# EAGLE design fl3xwatch (EAGLE 9.6.2)
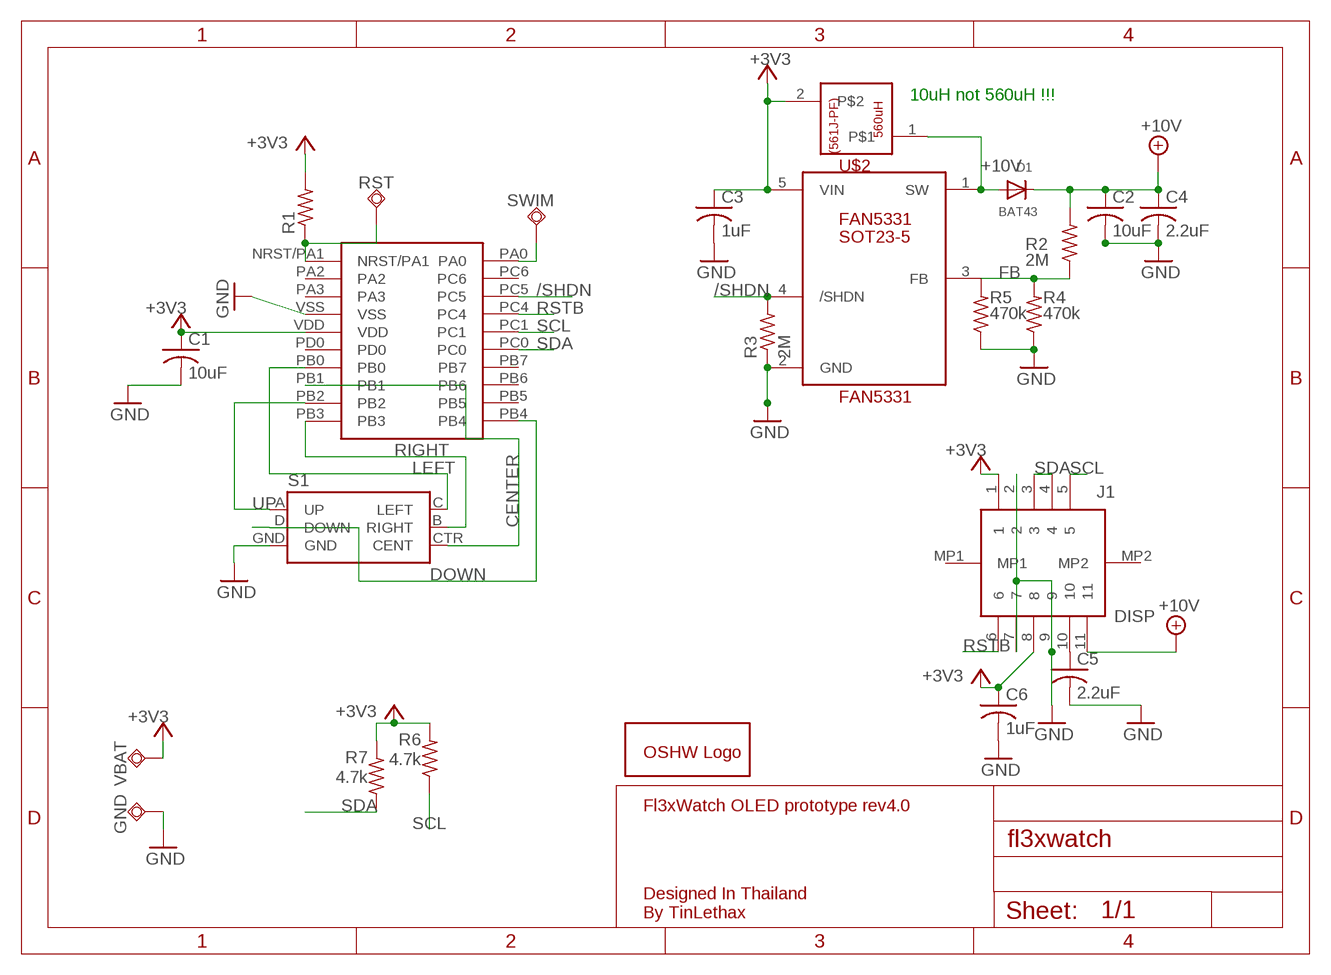
[diagram p0: schematic, sheet 1]

## Parts
C1  10uF  C-USC0805  [C0805]
C2  10uF  C-USC0805  [C0805]
C3  1uF  C-USC0603  [C0603]
C4  2.2uF  C-USC0603  [C0603]
C5  2.2uF  C-USC0603  [C0603]
C6  1uF  C-USC0603  [C0603]
D1  BAT43  DIODESOD-323F  [SOD-323F]
GND  TPSQTP20SQ  [TP20SQ]
GOLD_ORB_SM1  OSHWLOGOLOGO5MM  [OSHW_5MM]
J1  DISP  FH35C-11S-0.3SHW_50_  [FH35C11S03SHW50]
L1  10uH  NL453232T-561J-PF  [INDC4526X50N]
R1  R-US_R0603  [R0603]
R2  2M  R-US_R0603  [R0603]
R3  2M  R-US_R0603  [R0603]
R4  470k  R-US_R0805  [R0805]
R5  470k  R-US_R0805  [R0805]
R6  4.7k  R-US_R0603  [R0603]
R7  4.7k  R-US_R0603  [R0603]
RST  TPSQTP15R  [TP15R]
S1  SPARKFUN-ELECTROMECHANICAL_JOYSTICK_MINI  [SPARKFUN-ELECTROMECHANICAL_JOYSTICK_MINI]
SWIM  TPSQTP15R  [TP15R]
U$1  STM8L151F3  [UFQFPN-20]
U$2  FAN5331  [SOT95P280X145-5N]
VBAT  TPSQTP20SQ  [TP20SQ]

## Nets
+3V3: C1.1 C3.1 C6.1 J1.1 J1.8 L1.2 R1.2 R6.2 R7.2 U$1.VDD U$2.5(VIN) VBAT.TP
+10V: C2.1 C4.1 D1.C J1.11 R2.2
/SHDN: R3.2 U$1.PC5 U$2.4(/SHDN)
CENTER: S1.CTR(CENT) U$1.PB1
DOWN: S1.D(DOWN) U$1.PB4
FB: R2.1 R4.2 R5.2 U$2.3(FB)
GND: C1.2 C2.2 C3.2 C4.2 C5.2 C6.2 GND.TP J1.2 J1.7 J1.9 R3.1 R4.1 R5.1 S1.GND U$1.VSS U$2.2(GND)
LEFT: S1.C(LEFT) U$1.PB0
N$1: R1.1 RST.TP U$1.NRST/PA1
N$2: C5.1 J1.10
RIGHT: S1.B(RIGHT) U$1.PB3
RSTB: J1.6 U$1.PC4
SCL: J1.5 R6.1 U$1.PC1
SDA: J1.3 J1.4 R7.1 U$1.PC0
SW: D1.A L1.1 U$2.1(SW)
SWIM: SWIM.TP U$1.PA0
UP: S1.A(UP) U$1.PB2
Unconnected: J1.MP1 J1.MP2 U$1.PA2 U$1.PA3 U$1.PB5 U$1.PB6 U$1.PB7 U$1.PC6 U$1.PD0

## Notes on the sheet
- 10uH not 560uH !!!
- Fl3xWatch OLED prototype rev4.0
- Designed In Thailand
  By TinLethax

## Library data of the parts
C1-C6 = adafruit:C-US: CAPACITOR, American symbol
D1 = adafruit:DIODE: Diode SMADIODE - SMA Surface Mount Package 20V 1A Schottky Diode Digikey: 641-1014-6-ND DO-1N4148 - Through Hole Small Current Diode SOD-123 20V 1 A (.5mV Vf) Schottky Diode - Digikey: MBRX120TPMSCT-ND SOD-323 10V 570mA (.38mV Vf, 3ns) Schottky Diode - Digikey: ZLLS410CT-ND SOD-523 30V 30mA Schottky Diode (RB751S-40TE61) - Digikey: RB751S-40TE61CT-ND SOT23-R/W - SOT23 Package (R = Solder Paste/Reflow Ovens, W = Hand-Soldering) BAT54Film 40V 300mA - Digikey: 497-7162-1-ND
GND RST SWIM VBAT = testpad:TPSQ: Test pad
GOLD_ORB_SM1 = oshw:OSHWLOGO: The OSHW logo for PCB layout
J1 = FH35C-11S-0.3SHW_50_:FH35C-11S-0.3SHW_50_: FFC & FPC Connectors 11P BCKFLP DUAL-SIDE FPC 0.3mm P 0.9mm H Source: Datasheet <http://www.mouser.com/datasheet/2/185/FH35C_catalog-939278.pdf>; DESCRIPTION: FFC & FPC Connectors 11P BCKFLP DUAL-SIDE FPC 0.3mm P 0.9mm H; HEIGHT: 1.8mm; MANUFACTURER_NAME: Hirose; MANUFACTURER_PART_NUMBER: FH35C-11S-0.3SHW(50); MOUSER_PART_NUMBER: 798-FH35C11S03SHW50; MOUSER_PRICE-STOCK: https://www.mouser.com/Search/Refine.aspx?Keyword=798-FH35C11S03SHW50
L1 = 561J-PF:NL453232T-561J-PF
R1-R7 = adafruit:R-US_: RESISTOR, American symbol
S1 = SparkFun_5-Way_Tactile_Switch_Breakout:SPARKFUN-ELECTROMECHANICAL_JOYSTICK_MINI: Small 5-way tactile joystick, COM-10063 4UCON SF303GJ26
U$1 = STM8L151F3:STM8L151F3: STM8L151F3 8bit mcuwith the 3x3 mm size !
U$2 = fan5331:FAN5331: The FAN5331 is a general purpose, fixed-frequency boost converter designed to operate at high switching frequencies in order to minimize switching noise measured at the battery terminal of hand-held communications equipment. Quiescent current in normal mode of operation as well as in shutdown mode is designed to be minimal in order to extend battery life. Normal mode of operation or shutdown mode can be selected by a logic level shutdown circuitry. The low ON-resistance of the internal N-channel switch ensures high efficiency and low power dissipation. A cycle-by-cycle current limit circuit keeps the peak current of the switch below a typical value of 1A. The FAN5331 is available in a 5-lead SOT-23 package.

## Board
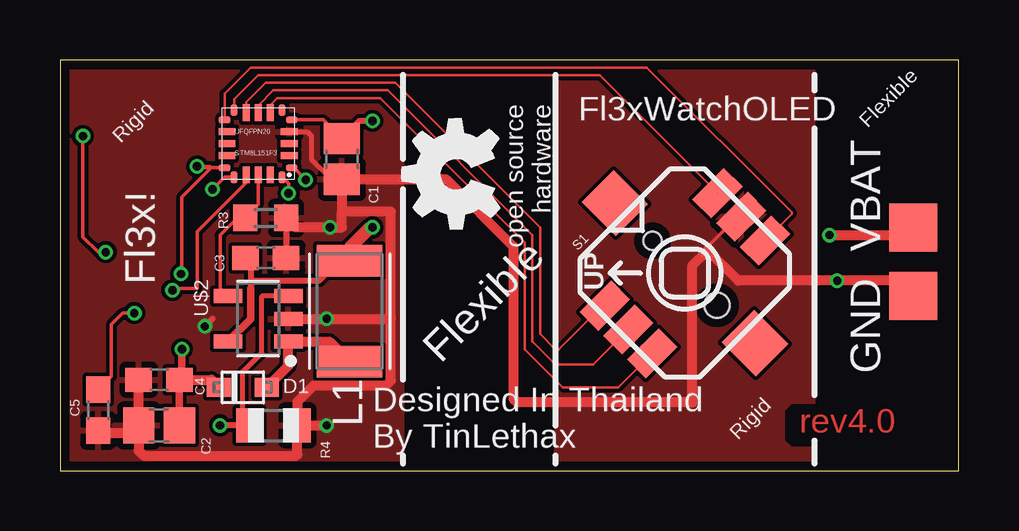
[diagram p1: board, top side]
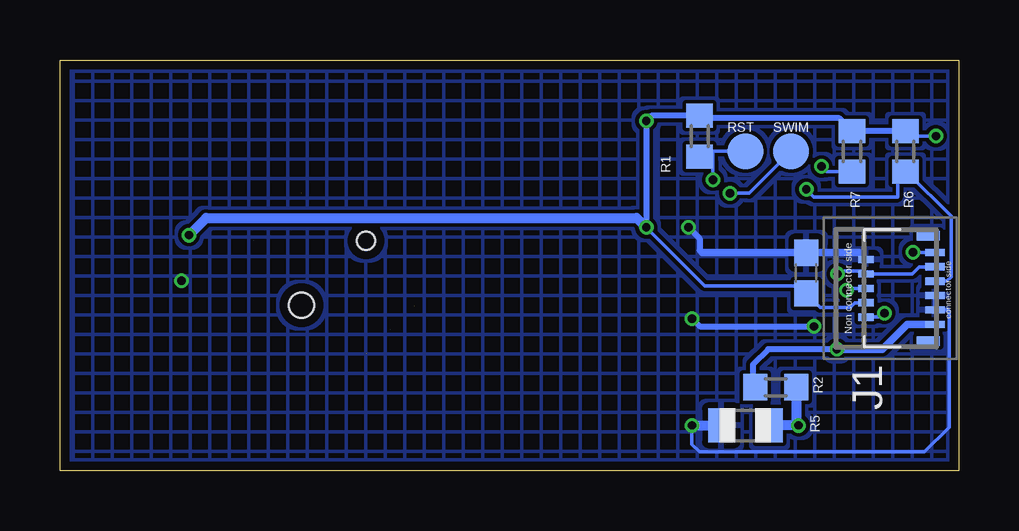
[diagram p2: board, bottom side, seen from below]

Size 37.45 x 17.14 mm. Coordinates in mm from the lower left corner, seen from the top.
Outline: 0,0 37.44,0 37.44,17.14 0,17.14 0,0
Copper layers (1*16): Top 0.035559375mm / dielectric 1.6mm / Bottom 0.035559375mm
Design rules "oshpark-2layer": minimum track width 6mil, minimum drill 10mil, track to track 6mil, track to pad 6mil, pad to pad 6mil, via to via 6mil, smd to smd 6mil, copper to edge 15mil, drill to drill 6mil, minimum pad ring 5mil, minimum via ring 5mil, stop-mask expansion 2.5mil, vias tented up to drill 0mil, thermal gap 10mil

### Footprints (pad centres in the part's own frame; a part is rotated, then mirrored left to right if it is on the bottom)
C0805 = smd 1.3 x 1.5: 1 -0.85,0; 2 0.85,0
C0603 = smd 1.1 x 1: 1 -0.85,0; 2 0.85,0
SOD-323F = smd 1 x 0.8: A -1,0; C 1,0
TP20SQ = smd 2 x 2: TP 0,0
FH35C11S03SHW50 = smd 0.3 x 0.8: 1 1.5,-1.869; 3 0.9,-1.869; 5 0.3,-1.869; 7 -0.3,-1.869; 9 -0.9,-1.869; 11 -1.5,-1.869 | smd 0.3 x 0.65: 2 1.2,1.006; 4 0.6,1.006; 6 0,1.006; 8 -0.6,1.006; 10 -1.2,1.006 | smd 0.4 x 0.95: MP1 -2.2,-1.594; MP2 2.2,-1.594
INDC4526X50N = smd 1.314 x 2.729: 1 -2.098,0; 2 2.098,0
R0603 = smd 1 x 1.1: 1 -0.85,0; 2 0.85,0
R0805 = smd 1.1 x 1.4: 1 -1,0; 2 1,0
TP15R = smd 1.5 x 1.5: TP 0,0
SPARKFUN-ELECTROMECHANICAL_JOYSTICK_MINI = smd 1.85 x 1.1: A -3.325,1.4; B 3.325,1.4; C -3.325,-1.4; CTR -3.325,0; D 3.325,-1.4; GND 3.325,0 | smd 1.9 x 2: NC 0,4.13; NC@0 0,-4.13 | hole 0.75: 0,1.9 | hole 1.05: 0,-1.9
UFQFPN-20 = smd 0.5 x 0.3: NRST/PA1 -1.4,1; PB4 1.4,-1; PC0 1.4,1; VDD -1.4,-1 | smd 0.3 x 0.5: PA0 -1,1.4; PB3 1,-1.4; PC1 1,1.4; PD0 -1,-1.4 | smd 0.7 x 0.3: PA2 -1.3,0.5; PA3 -1.3,0; PB5 1.3,-0.5; PB6 1.3,0; PB7 1.3,0.5; VSS -1.3,-0.5 | smd 0.3 x 0.7: PB0 -0.5,-1.3; PB1 0,-1.3; PB2 0.5,-1.3; PC4 0.5,1.3; PC5 0,1.3; PC6 -0.5,1.3
SOT95P280X145-5N = smd 1.186 x 0.589: 1 -1.264,0.95; 2 -1.264,0; 3 -1.264,-0.95; 4 1.264,-0.95; 5 1.264,0.95

### Placement (x,y rotation side)
C1  11.75,13.02 270 top
C2  4.13,1.91 180 top
C3  8.57,8.89 0 top
C4  4.13,3.81 180 top
C5  1.59,2.54 270 top
C6  6.35,8.26 90 bottom
D1  7.62,3.49 180 top
GND  35.56,7.3 90 top
GOLD_ORB_SM1  16.51,12.38 90 top
J1  2.86,7.62 90 bottom
L1  12.07,6.67 90 top
R1  10.79,13.97 90 bottom
R2  7.62,3.49 180 bottom
R3  8.57,10.56 180 top
R4  8.89,1.91 180 top
R5  8.89,1.91 0 bottom
R6  2.22,13.34 90 bottom
R7  4.45,13.34 90 bottom
RST  8.89,13.34 0 bottom
S1  26.04,8.26 45 top
SWIM  6.99,13.34 0 bottom
U$1  8.26,13.65 180 top
U$2  8.26,6.35 180 top
VBAT  35.56,10.16 90 top

### Tracks (layer width: path | path; a pad name or v marks a point on that pad's centre or on a via)
+3V3  (via drill 0.35)
  Top 0.152: U$1.VDD 10.96,14.65 C1.1 | v0.95,13.97 0.95,9.76 1.59,9.13 v1.9,9.13
  Top 0.254: C1.1 12.49,14.61 v13.02,14.61 | C3.1 7.94,8.68 7.94,7.94 | 7.94,7.94 7.94,7.62 | 11.75,8.89 10.79,7.94 7.94,7.94 | L1.2 12.07,9.4
  Top 0.305: U$2.5 7.94,6.35 7.94,7.62
  Top 0.406: 11.75,8.89 v13.02,10.16 12.82,10.16 12.07,9.4 | v32.07,9.84 35.24,9.84 VBAT.TP
  Bottom 0.152: R1.2 10.9,14.71 | v13.02,10.16 10.58,7.72 6.67,7.72 C6.1 5.77,6.83 4.52,6.83 4.33,7.02 J1.8 | v0.95,13.97 2.32,13.97 2.54,14.19 | v1.9,9.13 1.9,9.12 J1.1
  Bottom 0.254: R6.2 2.54,14.19 R7.2 4.97,14.71 10.9,14.71 | R1.2 12.8,14.82 v13.02,14.61 v13.02,10.16
  Bottom 0.406: v32.07,9.84 31.35,10.56 13.41,10.56 v13.02,10.16
+10V  (via drill 0.35)
  Top 0.305: v5.08,5.08 5.08,3.81 C4.1 C2.1
  Top 0.406: C4.1 6.3,3.81 D1.C
  Bottom 0.254: v5.08,5.08 7.94,5.08 8.57,4.45 8.57,3.6 R2.2
  Bottom 0.305: J1.11 2.13,6.12 3.17,5.08 v5.08,5.08
/SHDN
  Top 0.152: U$2.4 6.67,7.62 6.67,9.84 7.38,10.56 R3.2 7.72,10.58 8.26,11.11 U$1.PC5
CENTER  (1 unrouted)
  Top 0.102: U$1.PB1 8.26,15.24 8.89,15.88 13.65,15.88 19.68,9.84 19.68,5.4 20.64,4.45 22.22,4.45 S1.CTR
DOWN  (1 unrouted)
  Top 0.102: U$1.PB4 6.85,15.74 7.94,16.83 24.45,16.83 30.48,10.79 30.48,10.72 S1.D
FB  (via drill 0.35)
  Top 0.203: U$2.3 8.41,7.3 8.41,4.92 7.62,4.13 7.62,2.17 R5.2
  Top 0.254: R5.2 v6.67,1.91
  Bottom 0.406: R2.1 6.77,2.01 v6.67,1.91 R5.2
GND  (via drill 0.35)
  Top 0.152: 3.28,3.49 C4.2 | 11.7,12.12 C1.2 | 9.31,10.56 R3.1 | 26.99,9.21 26.99,9.37 28.73,11.11 28.73,10.95 S1.GND | C5.2 1.69,1.59
  Top 0.2: U$1.VSS 10.29,14.15 10.48,13.97 10.48,13.02 11.33,12.17 C1.2
  Top 0.254: R3.1 C3.2 | v6.03,6.03 6.35,6.35 | C1.2 11.75,12.06
  Top 0.406: 1.69,1.59 2.96,1.59 C2.2 | C2.2 3.28,3.49 | 11.75,10.79 11.75,10.16 v11.25,10.16 9.82,10.16 R3.1 | 11.75,12.06 11.75,10.79 | C1.2 16.09,12.17 18.89,9.37 18.89,3.02 19.05,2.86 26.35,2.86 26.35,8.57 26.99,9.21 28.26,7.94 v32.39,7.94 34.93,7.94 GND.TP | 13.79,6.35 13.79,3.77 13.58,3.56 10.55,3.56 9.89,2.89 R5.1 | 13.79,6.35 13.79,10.82 11.77,10.82 11.75,10.79 | R5.1 v11.11,1.91 | U$2.2 v11.11,6.35 13.79,6.35 | C2.2 3.28,0.85 3.49,0.64 9.84,0.64 9.89,0.68 R5.1
  Bottom 0.152: J1.7 J1.9 0.45,6.72 0.4,6.67 0.4,1.83 1.43,0.79 10.79,0.79 11.11,1.11 v11.11,1.91
  Bottom 0.254: v11.25,10.16 10.79,9.7 10.79,9.21 10.69,9.11 | v11.11,6.35 10.79,6.03 v6.03,6.03
  Bottom 0.305: J1.2 4.15,9.11 C6.2 | C6.2 10.69,9.11 C6.2
  Bottom 0.406: v11.11,1.91 R5.1
  pour Bottom (hatched): 0,17.14 37.47,17.14 37.47,0 0,0
  pour Top: 0,17.14 14.29,17.14 14.29,0 0,0
  pour Top: 20.64,17.14 20.64,0.32 20.64,0 31.43,0 31.43,0.95 30.48,0.95 30.16,1.27 30.16,2.54 30.48,2.86 31.43,2.86 31.43,16.83 31.43,17.14
LEFT  (1 unrouted)
  Top 0.102: U$1.PB0 8.76,15.26 9.05,15.56 13.34,15.56 19.37,9.53 19.37,5.08 20.95,3.49 23.25,3.49 S1.C
N$1  (via drill 0.35)
  Top 0.152: v10.24,12.14 9.73,12.65 U$1.NRST/PA1
  Bottom 0.152: RST.TP 10.24,13.34 v10.24,12.14 10.24,12.88 10.48,13.12 R1.1
N$2  (via drill 0.35)
  Top 0.152: v3.1,6.59 2.62,6.59 2.14,6.11 2.14,3.95 C5.1
  Bottom 0.152: J1.10 3.26,6.42 v3.1,6.59
RIGHT  (1 unrouted)
  Top 0.102: U$1.PB3 7.26,15.51 8.26,16.51 22.48,16.51 S1.B
RSTB  (via drill 0.35)
  Top 0.152: U$1.PC4 7.76,12.04 5.71,9.99 5.71,7.62 4.76,7.62 v4.68,7.54
  Bottom 0.152: J1.6 4.68,7.62 v4.68,7.54
SCL  (via drill 0.35)
  Top 0.152: v6.35,11.75 6.85,12.25 U$1.PC1
  Bottom 0.152: v6.35,11.75 6.03,11.43 2.54,11.43 2.54,12.17 2.27,12.43 | R6.1 2.27,12.43 | J1.5 0.49,7.92 0.32,8.1 0.32,10.64 2.12,12.43 2.27,12.43
SDA  (via drill 0.35)
  Top 0.152: v5.05,8.22 5.08,8.26 5.08,11.43 6.3,12.65 6.22,12.65 6.27,12.7 v5.71,12.7 5.76,12.65 U$1.PC0
  Bottom 0.152: R7.1 5.5,12.48 v5.71,12.7 | J1.3 1.64,8.52 1.94,8.22 J1.4 3.98,8.33 4.93,8.33 v5.05,8.22
SW
  Top 0.406: L1.1 11.23,5.4 U$2.1 9.52,4.39 D1.A
SWIM  (via drill 0.35)
  Top 0.152: v9.52,11.59 9.52,11.98 U$1.PA0
  Bottom 0.152: v9.52,11.59 8.73,11.59 SWIM.TP
UP  (1 unrouted)
  Top 0.102: S1.A 22.69,6.99 20.79,5.08 20.64,5.08 20,5.71 20,10.16 13.97,16.19 8.57,16.19 7.76,15.38 U$1.PB2

### Text on the board
Top: rev4.0
tNames: Fl3xWatchOLED | Rigid | Flexible | Fl3x! | Flexible | Designed In Thailand / By TinLethax | Rigid